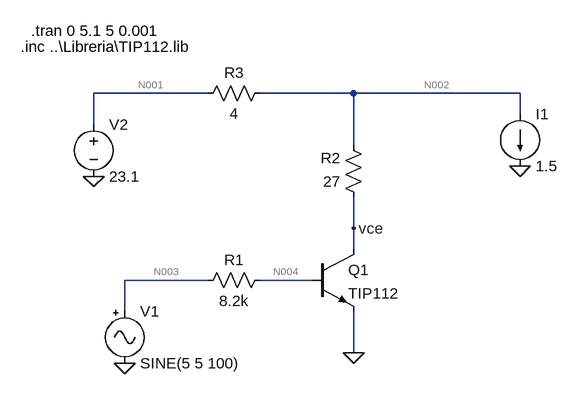
[diagram p0: schematic Draft1.asc]
Draft1.asc, the LTspice schematic file:
Version 4
SHEET 1 880 680
WIRE 0 -64 -176 -64
WIRE 224 -64 80 -64
WIRE 480 -64 224 -64
WIRE 480 -32 480 -64
WIRE -176 -16 -176 -64
WIRE 224 16 224 -64
WIRE 224 144 224 96
WIRE 224 176 224 144
WIRE 0 224 -128 224
WIRE 160 224 80 224
WIRE -128 272 -128 224
WIRE 224 336 224 272
FLAG 480 48 0
FLAG -128 352 0
FLAG -176 64 0
FLAG 224 336 0
FLAG 224 144 vce
SYMBOL npn 160 176 R0
SYMATTR InstName Q1
SYMATTR Value TIP112
SYMATTR Prefix X
SYMBOL res 96 208 R90
WINDOW 0 0 56 VBottom 2
WINDOW 3 32 56 VTop 2
SYMATTR InstName R1
SYMATTR Value 8.2k
SYMBOL res 240 112 R180
WINDOW 0 36 76 Left 2
WINDOW 3 36 40 Left 2
SYMATTR InstName R2
SYMATTR Value 27
SYMBOL Misc\\signal -128 256 R0
WINDOW 123 0 0 Left 2
WINDOW 39 0 0 Left 2
SYMATTR InstName V1
SYMATTR Value SINE(5 5 100)
SYMBOL voltage -176 -32 R0
WINDOW 123 0 0 Left 2
WINDOW 39 0 0 Left 2
SYMATTR InstName V2
SYMATTR Value 23.1
SYMBOL res 96 -80 R90
WINDOW 0 0 56 VBottom 2
WINDOW 3 32 56 VTop 2
SYMATTR InstName R3
SYMATTR Value 4
SYMBOL current 480 -32 R0
WINDOW 123 0 0 Left 2
WINDOW 39 0 0 Left 2
SYMATTR InstName I1
SYMATTR Value 1.5
TEXT -288 -136 Left 2 !.inc ..\\Libreria\\TIP112.lib
TEXT -272 -160 Left 2 !.tran 0 5.1 5 0.001

The netlist it stands for:
* Draft1.asc
XQ1 vce N004 0 TIP112  ; pins C B E
R1 N004 N003 8.2k
R2 vce N002 27
V1 N003 0 SINE(5 5 100)
V2 N001 0 23.1
R3 N002 N001 4
I1 N002 0 1.5
.inc ..\Libreria\TIP112.lib
.tran 0 5.1 5 0.001
.backanno
.end

* Results of the author's LTspice run, read from the files saved beside the schematic
* Operating Point, zero values left out:
*   V(vce) = 933.8 mV
*   V(n004) = 1.316 V
*   V(n003) = 5 V
*   V(n002) = 15.01 V
*   V(n001) = 23.1 V
*   I(I1) = 1.5 A
*   I(R3) = -2.021 A
*   I(R2) = -521.5 mA
*   I(R1) = -449.3 µA
*   I(V2) = -2.021 A
*   I(V1) = -449.3 µA
*   Ix(q1:1) = 521.5 mA
*   Ix(q1:2) = 449.2 µA
*   Ix(q1:3) = -521.9 mA
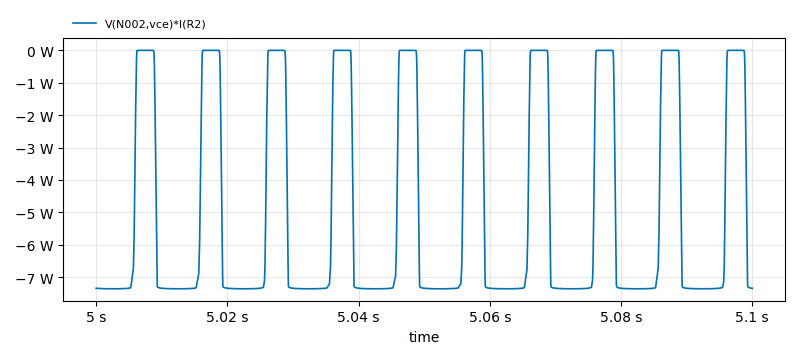
[diagram p1: Transient Analysis of Draft1.asc, plotted from the saved traces]
* Transient Analysis, 1 run:
*   V(N002,vce)*I(R2): min -7.359 W, max 0 W, average -5.017 W, rms 6.001 W, last -7.343 W